# Altium schematic sheet ADC_MCP3008.SchDoc
size A
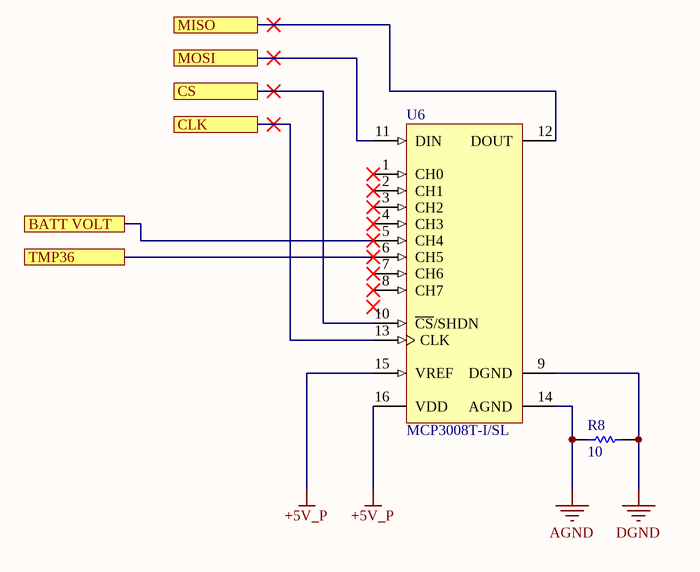
[diagram p0: ADC_MCP3008.SchDoc]

## Parts
R8  10  [RESC3216X60X45ML10T20]
U6  MCP3008T-I/SL  [SOIC-SL16_N]

## Ports
BATT VOLT, CLK, CS, MISO, MOSI, TMP36

## Nets
+5V_P: U6.15(VREF) U6.16(VDD)
AGND: R8.1 U6.14(AGND)
DGND: R8.2 U6.9(DGND)
BATT VOLT: U6.5(CH4) ; port BATT VOLT
CLK: U6.13(CLK) ; port CLK
CS: U6.10(~{CS}/SHDN) ; port CS
MISO: U6.12(DOUT) ; port MISO
MOSI: U6.11(DIN) ; port MOSI
TMP36: U6.6(CH5) ; port TMP36

Not connected (* = marked no-connect by the designer): U6 1(CH0)* 2(CH1)* 3(CH2)* 4(CH3)* 7(CH6)* 8(CH7)*

## Library data of the parts
R8 = CMP-2003-04815-1: Manufacturer: Vishay Dale; Part Number: CRCW120610R0FKEA
U6 = CMP-0188-00351-2: 2.7V 4-Channel/8-Channel 10-Bit A/D Converters with SPI Serial Interface, 16-Pin SOIC 150mil, Industrial Temperature, Tape and Reel; ComponentLink2Description: Datasheet; Code_JEDEC: MS-012-AC; Code_IPC: SOIC127P600-16; ComponentLink1Description: Manufacturer URL; DatasheetVersion: revD, Dec-2008; PackageReference: SOIC-SL16; ComponentLink2URL: http://ww1.microchip.com/downloads/en/DeviceDoc/21295d.pdf; ComponentLink3Description: Package Specification; ComponentLink3URL: http://www.microchip.com/stellent/groups/techpub_sg/documents/packagingspec/en012702.pdf; PackageVersion: revBB, Aug-2009; RevisionNote: URLs added.; PackageDescription: 16-Lead Plastic Small Outline (SL) - Narrow, 3.90mm Body [SOIC]; ComponentLink1URL: http://www.microchip.com/